# Altium schematic sheet Ethernet.SchDoc: Apalis Evaluation Board 1.1
size A3; Organization: Toradex AG; Address1: Altsagenstrasse 5; Address2: Horw; Address3: 6048; Address4: Switzerland; DocumentNumber: 9; Revision: V1.1; SheetNumber: 9; SheetTotal: 32; PageSetup: Record=PageOptions|CenterHorizontal=True|CenterVertical=True|PrintScale=0.73|XCorrection=1.00|YCorrection=1.00|PrintKind=0|BorderSize=5000000|LeftOffset=0|BottomOffset=0|Orientation=2|PaperLength=1000|PaperWidth=1000|Scale=100|PaperSource=7|PrintQuality=-4|MediaType=1|DitherType=10|PaperKind=A4|PrintScaleMode=1
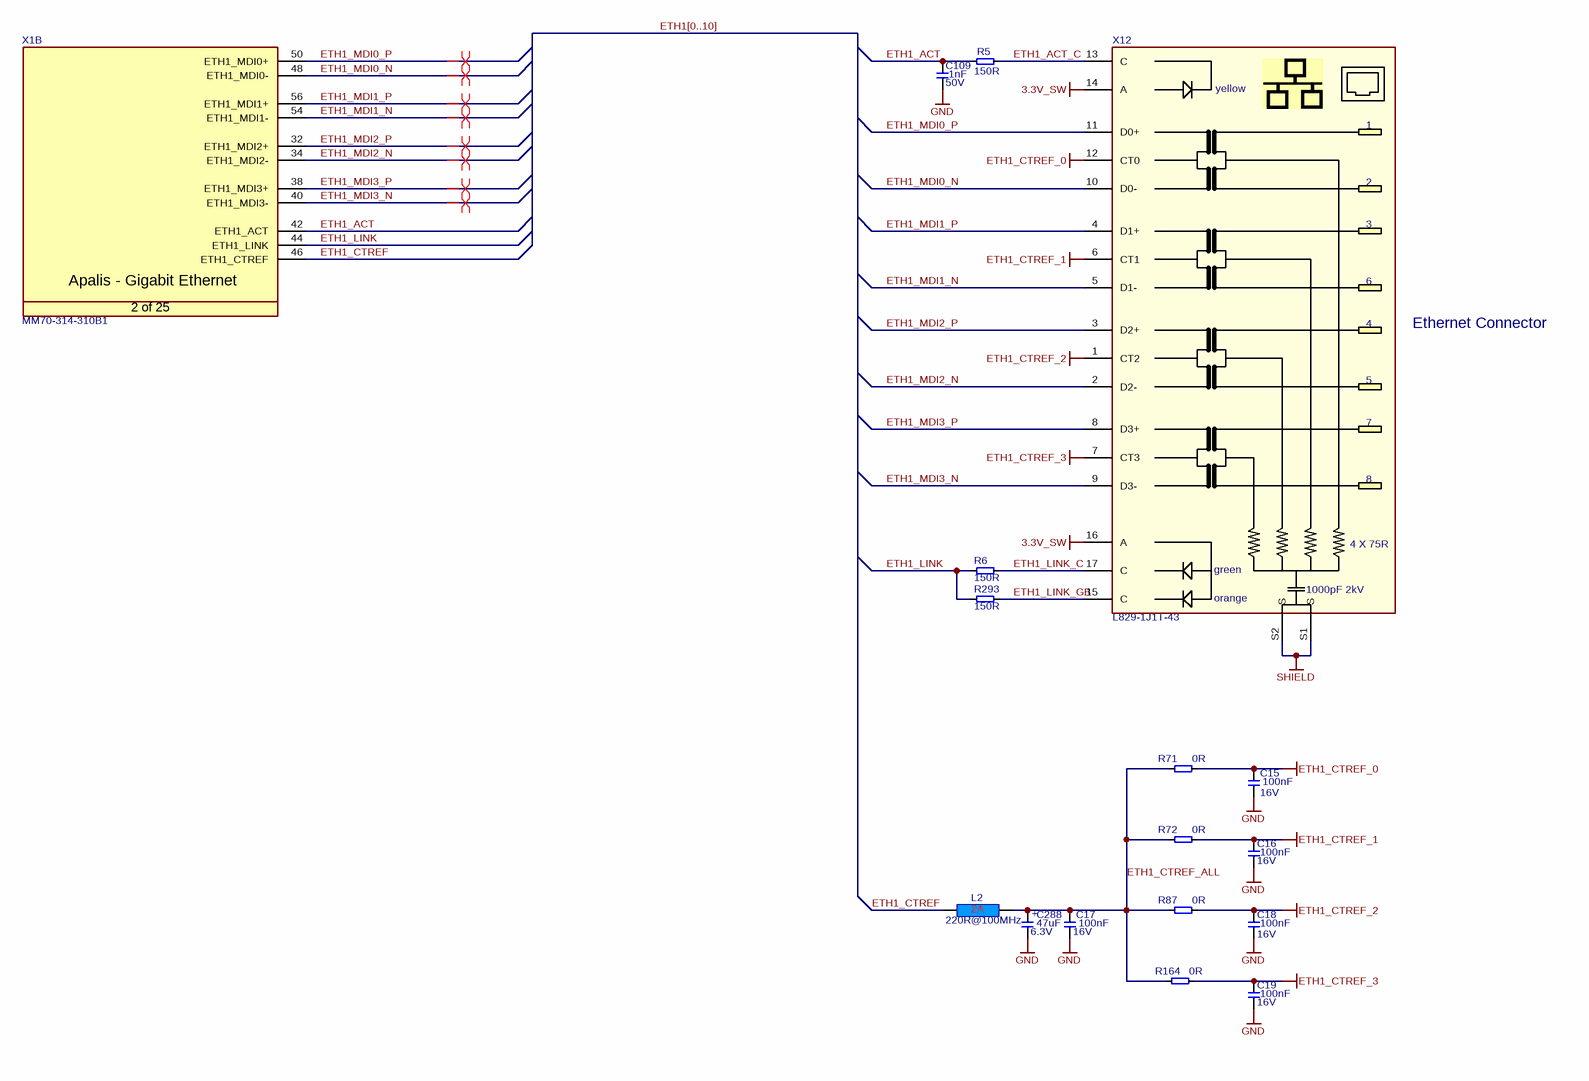
[diagram p0: Ethernet.SchDoc]

## Parts
C15  Rating: 16V  [T_CAPC0603X33N]  (hidden comment: 100nF)
C16  Rating: 16V  [T_CAPC0603X33N]  (hidden comment: 100nF)
C17  Rating: 16V  [T_CAPC0603X33N]  (hidden comment: 100nF)
C18  Rating: 16V  [T_CAPC0603X33N]  (hidden comment: 100nF)
C19  Rating: 16V  [T_CAPC0603X33N]  (hidden comment: 100nF)
C109  Rating: 50V  [CAPC1005X60N]  (hidden comment: 1nF)
C288  Rating: 6.3V  [T_CAPMP3216X180N]  (hidden comment: 47uF)
L2  220R@100MHz  [INDC1608X95N]
R5  150R  [t_RESC0603X30N]
R6  150R  [t_RESC0603X30N]
R71  0R  [T_RESC0603X30N]
R72  0R  [T_RESC0603X30N]
R87  0R  [T_RESC0603X30N]
R164  0R  [T_RESC0603X30N]
R293  150R  [t_RESC0603X30N]
X1  Manufacturer Part No.: MM70-314-310B1  [T_JAE_MM70-314-310B1]  (hidden comment: CON-JAE-MM70-314-310B1-314-0.5mm)  (part B of 25)
X12  L829-1J1T-43  [T_BEL_L829-1J1T-43]

## Nets
3.3V_SW: X12.14(A) X12.16(A)
ETH1_CTREF_0: C15.2 R71.2 X12.12(CT0)
ETH1_CTREF_1: C16.2 R72.2 X12.6(CT1)
ETH1_CTREF_2: C18.2 R87.2 X12.1(CT2)
ETH1_CTREF_3: C19.2 R164.2 X12.7(CT3)
GND: C15.1 C16.1 C17.1 C18.1 C19.1 C109.1 C288.2
SHIELD: X12.S1(S) X12.S2(S)
ETH1_ACT: C109.2 R5.1 X1.42(ETH1_ACT)
ETH1_ACT_C: R5.2 X12.13(C)
ETH1_CTREF: L2.1 X1.46(ETH1_CTREF)
ETH1_CTREF_ALL: C17.2 C288.1 L2.2 R71.1 R72.1 R87.1 R164.1
ETH1_LINK: R6.1 R293.1 X1.44(ETH1_LINK)
ETH1_LINK_C: R6.2 X12.17(C)
ETH1_LINK_GB: R293.2 X12.15(C)
ETH1_MDI0_N: X1.48(ETH1_MDI0-) X12.10(D0-)
ETH1_MDI0_P: X1.50(ETH1_MDI0+) X12.11(D0+)
ETH1_MDI1_N: X1.54(ETH1_MDI1-) X12.5(D1-)
ETH1_MDI1_P: X1.56(ETH1_MDI1+) X12.4(D1+)
ETH1_MDI2_N: X1.34(ETH1_MDI2-) X12.2(D2-)
ETH1_MDI2_P: X1.32(ETH1_MDI2+) X12.3(D2+)
ETH1_MDI3_N: X1.40(ETH1_MDI3-) X12.9(D3-)
ETH1_MDI3_P: X1.38(ETH1_MDI3+) X12.8(D3+)

## Buses and harness runs
bus ETH1[0..10]

## Layout directives
differential pair: ETH1_MDI0_N, ETH1_MDI0_P, ETH1_MDI1_N, ETH1_MDI1_P, ETH1_MDI2_N, ETH1_MDI2_P, ETH1_MDI3_N, ETH1_MDI3_P

## Notes on the sheet
- Ethernet Connector
- Title
- Size:
- Date:
- A3
- Number:
- Time:
- Revision:
- Sheet
- of
- File:
- (in symbol C-TA-47uF-6.3V-20%-3216) +
- (in symbol CON-BEL-L829-1J1T-43) yellow; 4 X 75R; green; 1000pF 2kV; orange
- (in symbol CON-JAE-MM70-314-310B1-314-0.5mm, part B) Apalis - Gigabit Ethernet; 2 of 25

## Library data of the parts
C15-C19 = C-X7R-100nF-16V-10%-0603: Capacitor Ceramic X7R 100nF 16V 10% 0603; Tolerance: 10%; Type: X7R; Value: 100nF
C109 = C-X7R-1nF-50V-10%-0402: Capacitor Ceramic X7R 1nF 50V 10% 0402; Tolerance: 10%; Type: X7R; Value: 1nF
C288 = C-TA-47uF-6.3V-20%-3216: Capacitor TA 47uF 6.3V 20% 3216; Tolerance: 20%; Type: TA; Value: 47uF
L2 = L-220R@100MHz-2A-25%-0603: 220R@100MHz 2A EMI FILTER; Tolerance: 25%; Rating: 2A; Value: 220R@100MHz
R5 R6 R293 = R-150R-63mW-1%-0603: Resistor 150 ohm 63mW 1% 0603; Tolerance: 1%; Value: 150R; Rating: 63mW
R71 R72 R87 R164 = R-0R-63mW-1%-0603: Resistor 0 ohm 63mW 1% 0603; Rating: 63mW; Tolerance: 1%; Value: 0R
X1 = CON-JAE-MM70-314-310B1-314-0.5mm: MXM3 Connector; Manufacturer Name: JAE; No. of ways: 314
X12 = CON-BEL-L829-1J1T-43: Low profile 10/100/1G Mag Jack; Manufacturer Name: BEL; Manufacturer Part No.: L829-1J1T-43